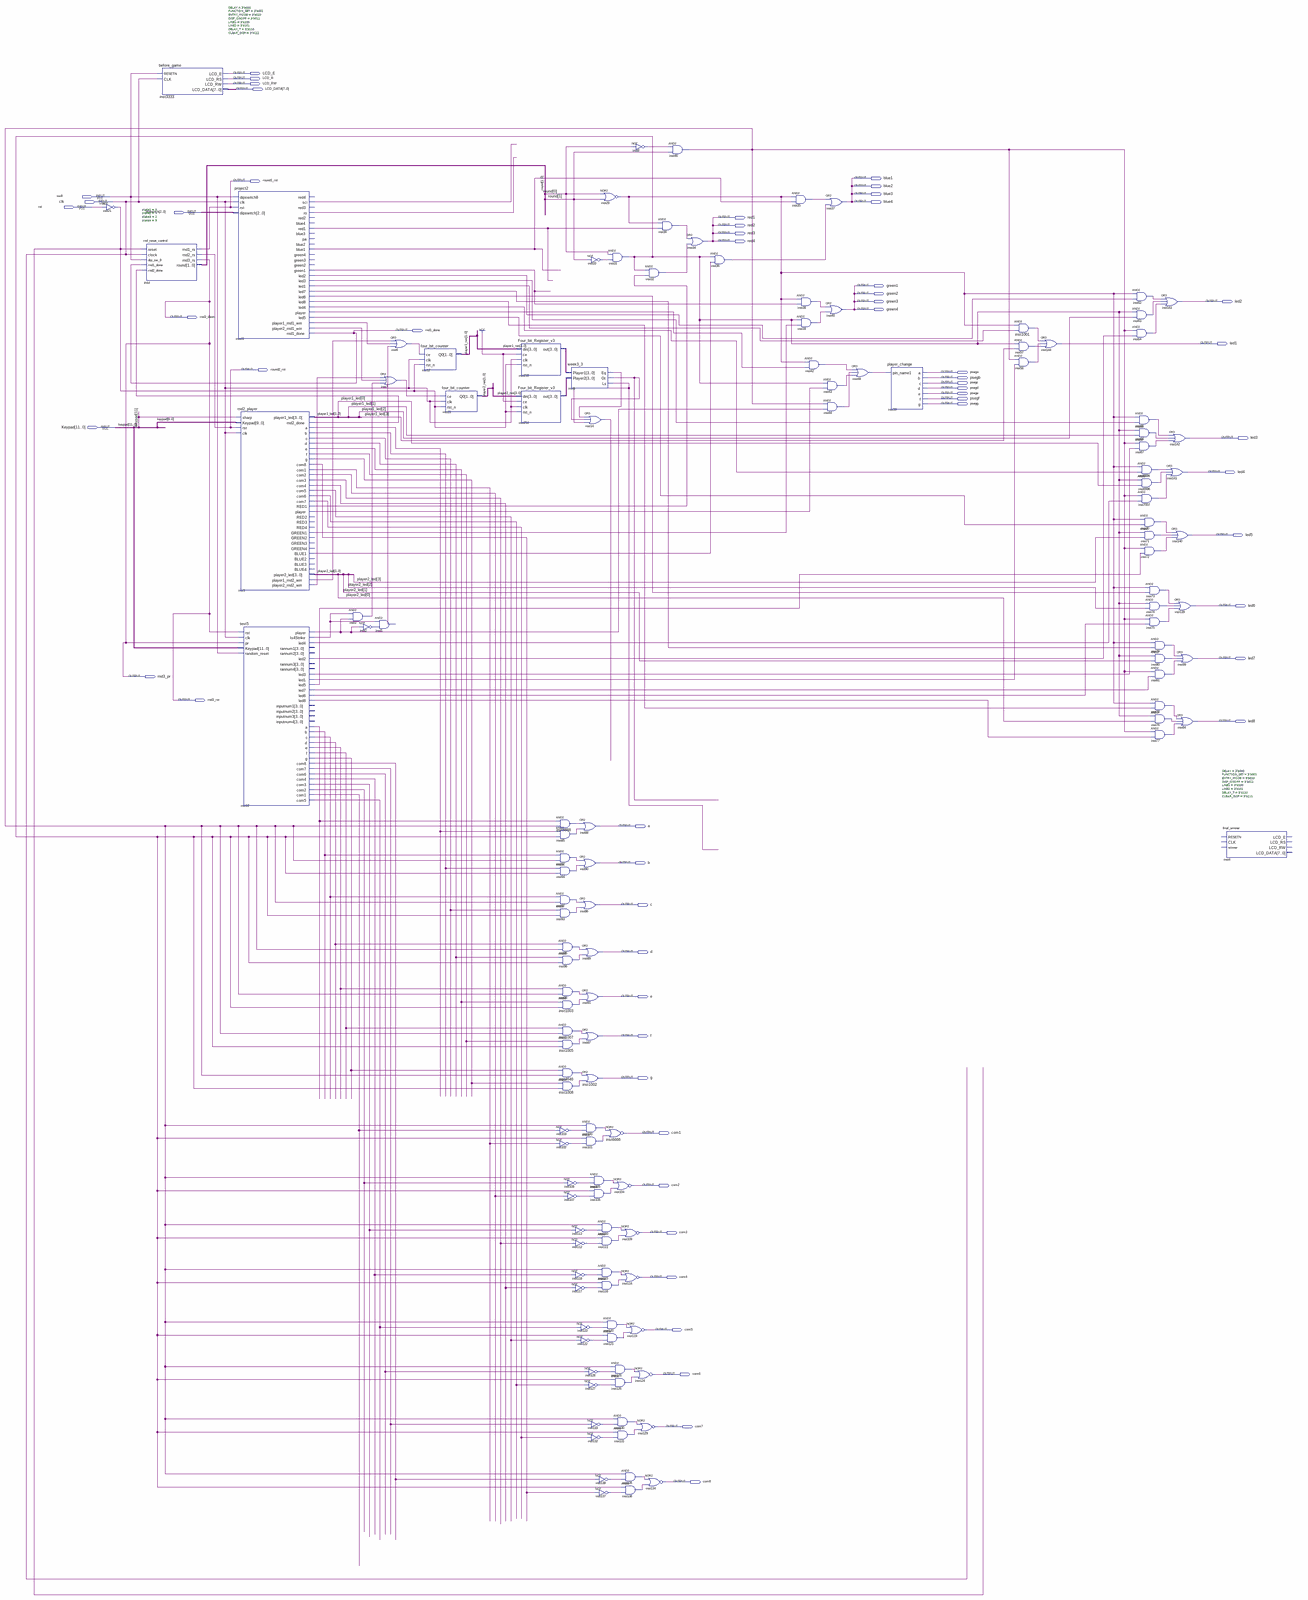
[diagram p0: schematic sheet, whole]
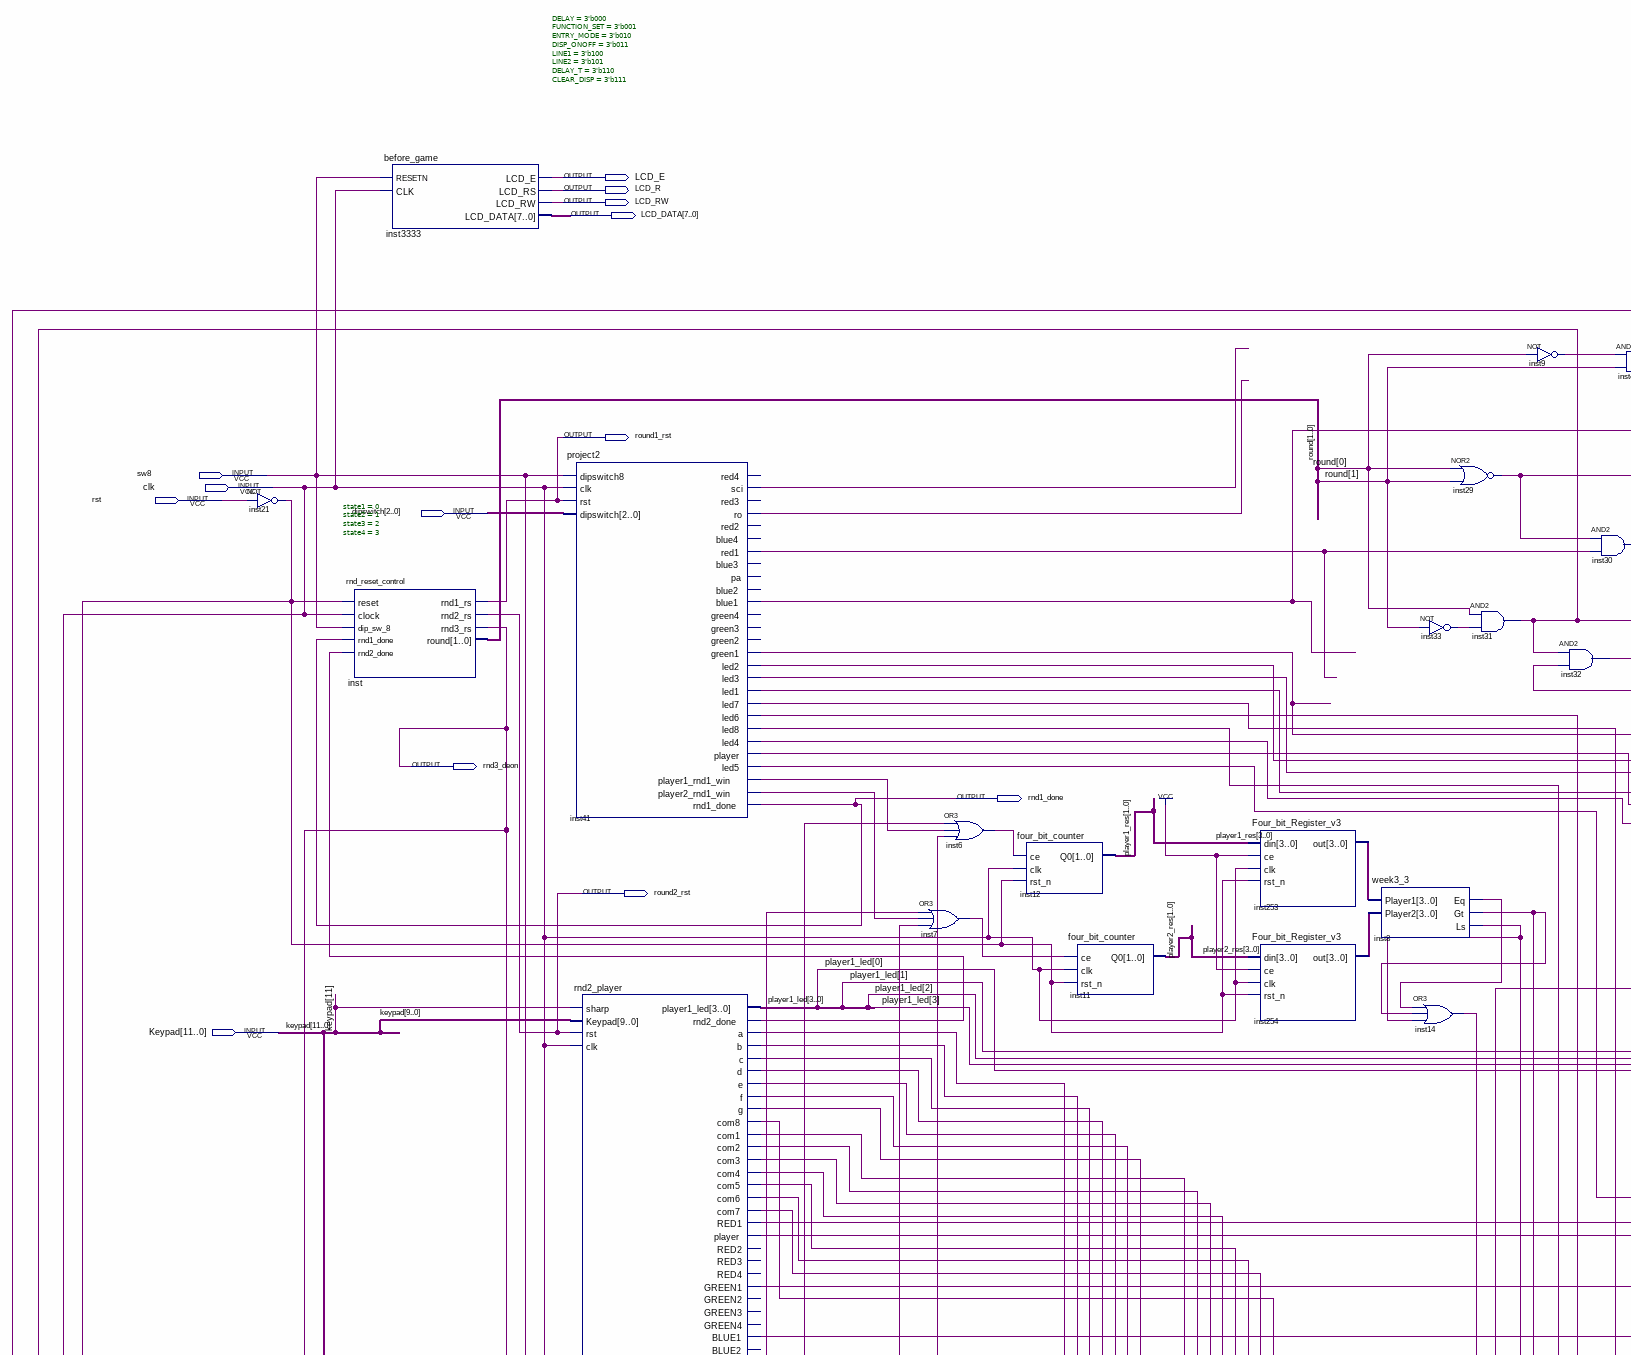
[diagram p1: schematic sheet, upper left part]
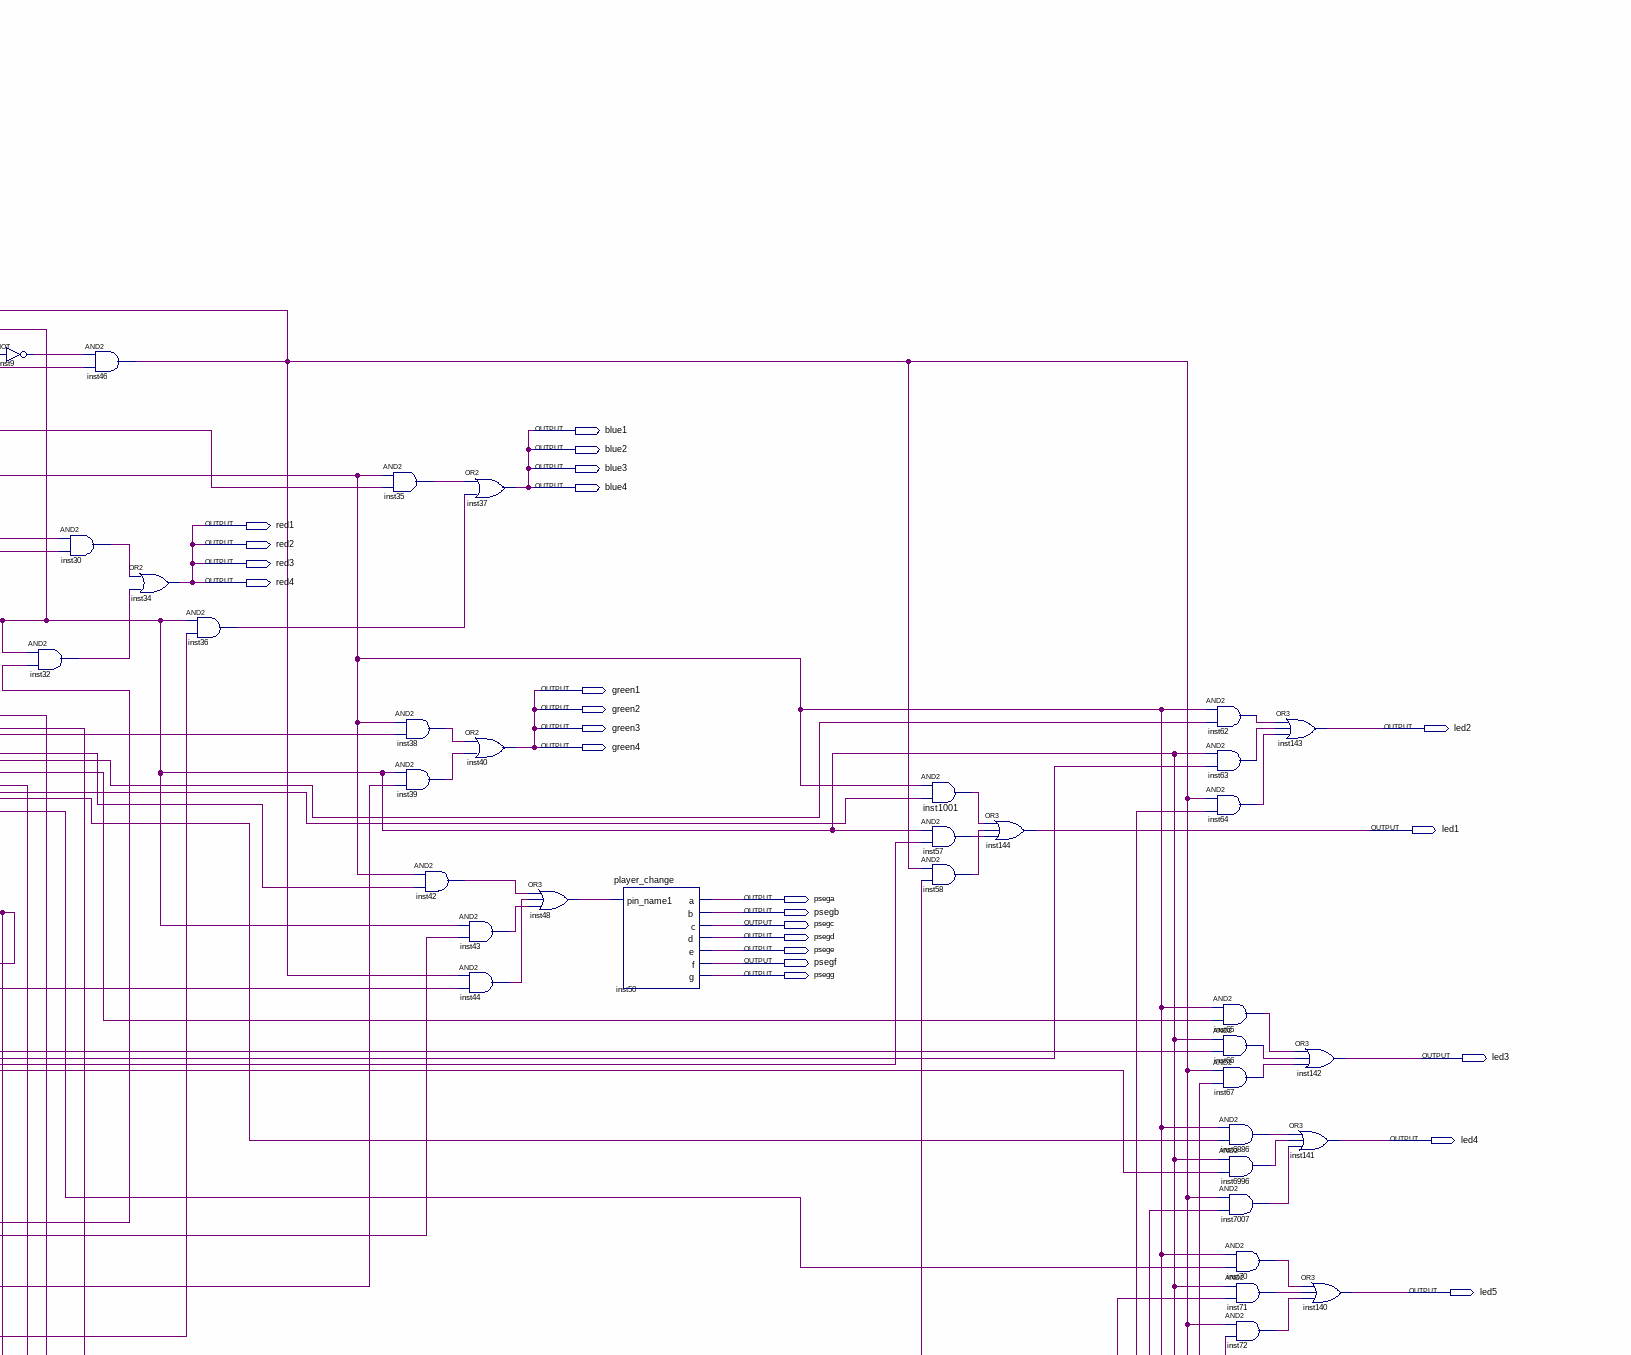
[diagram p2: schematic sheet, upper right part]
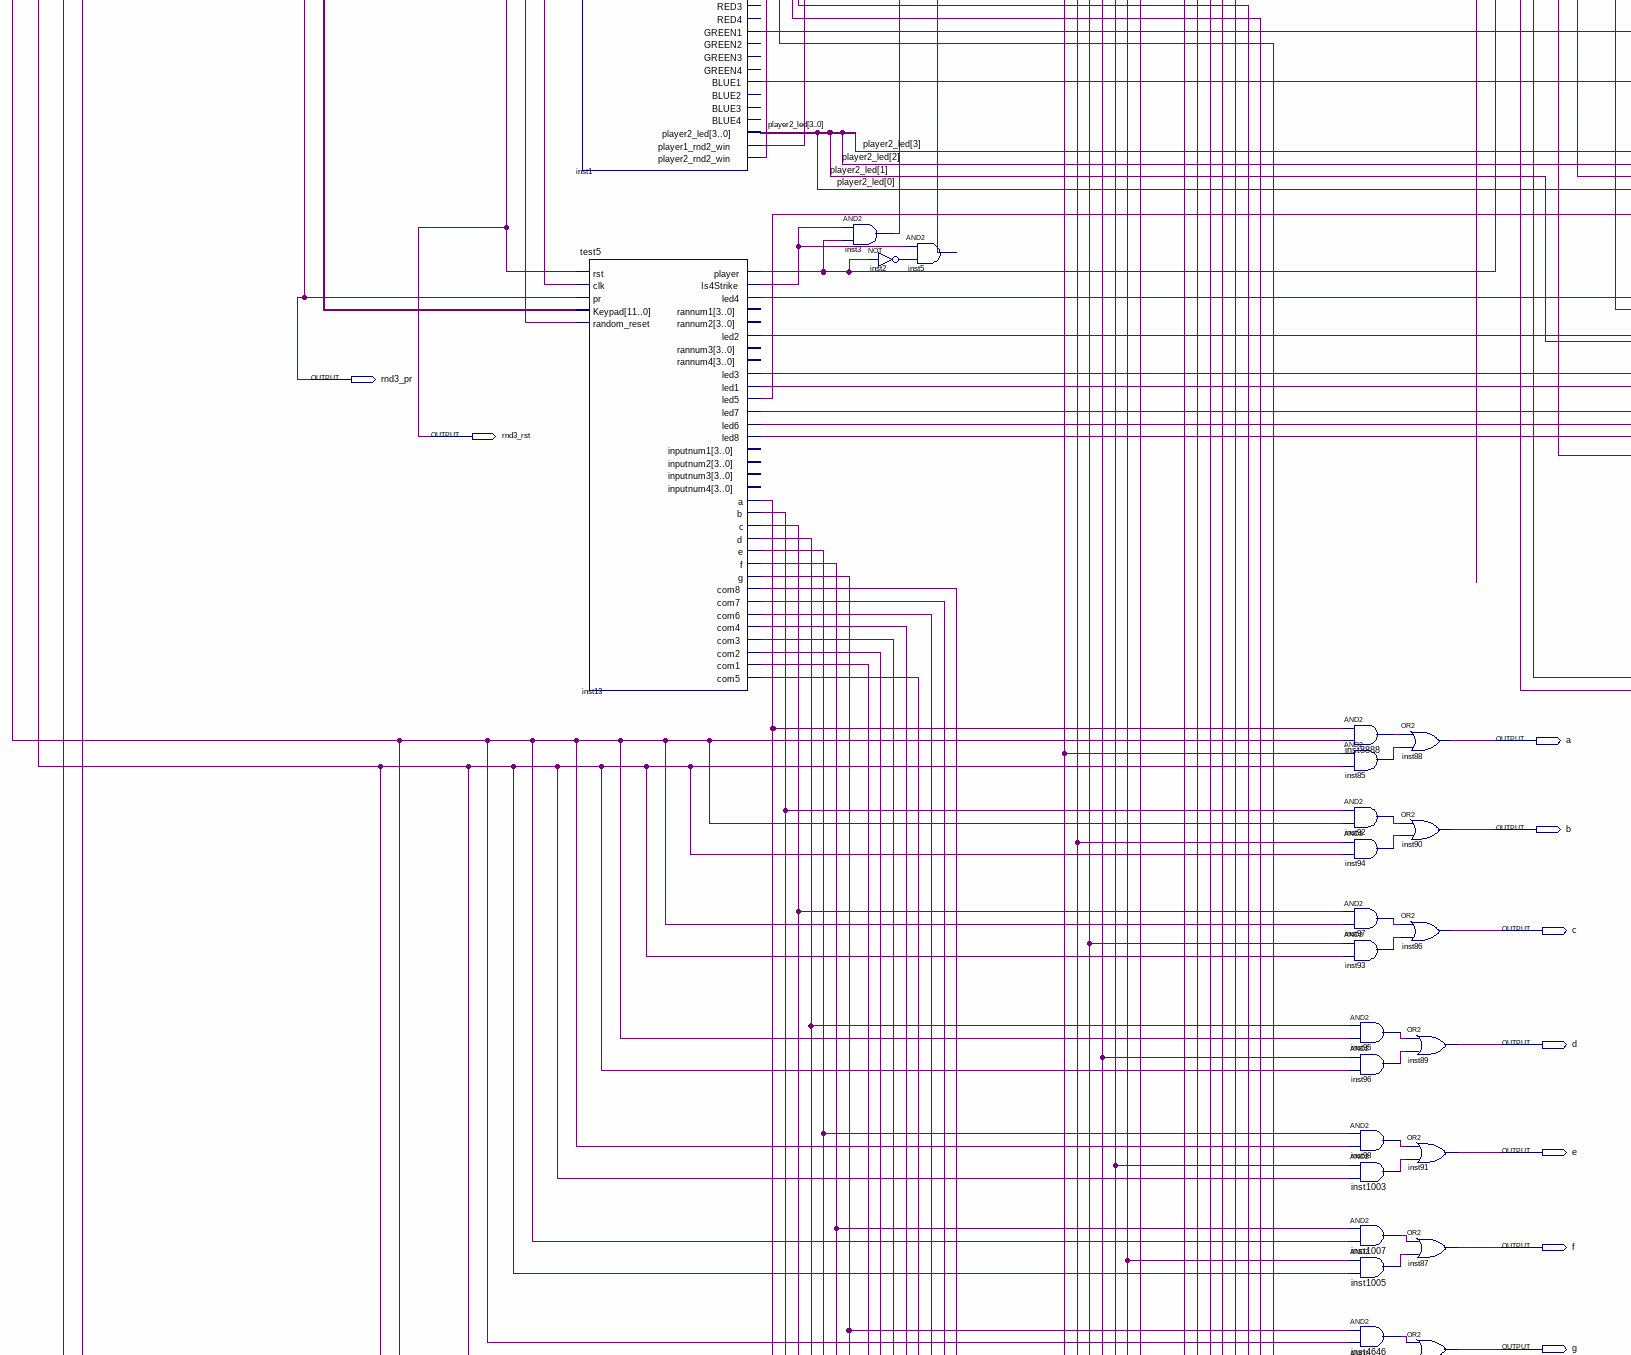
[diagram p3: schematic sheet, middle left part]
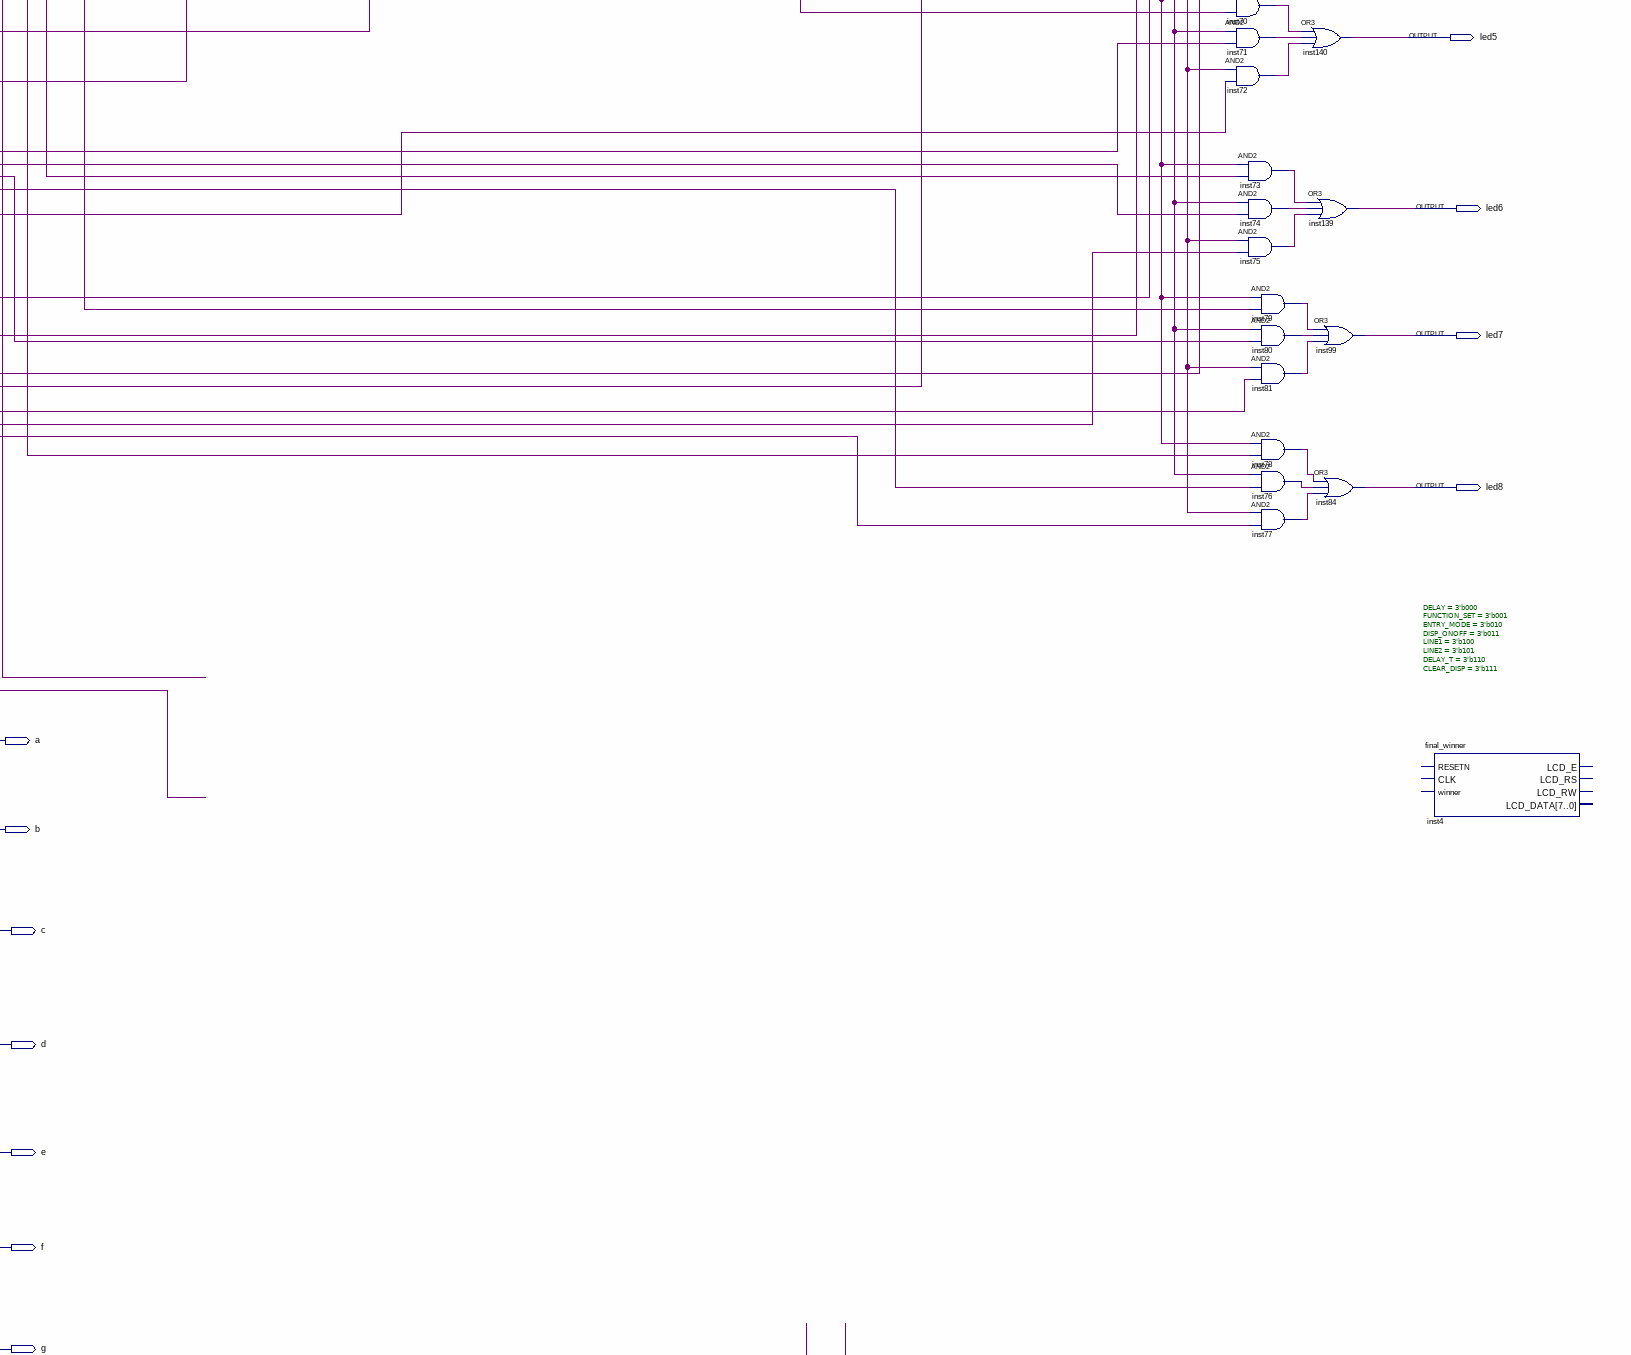
[diagram p4: schematic sheet, middle right part]
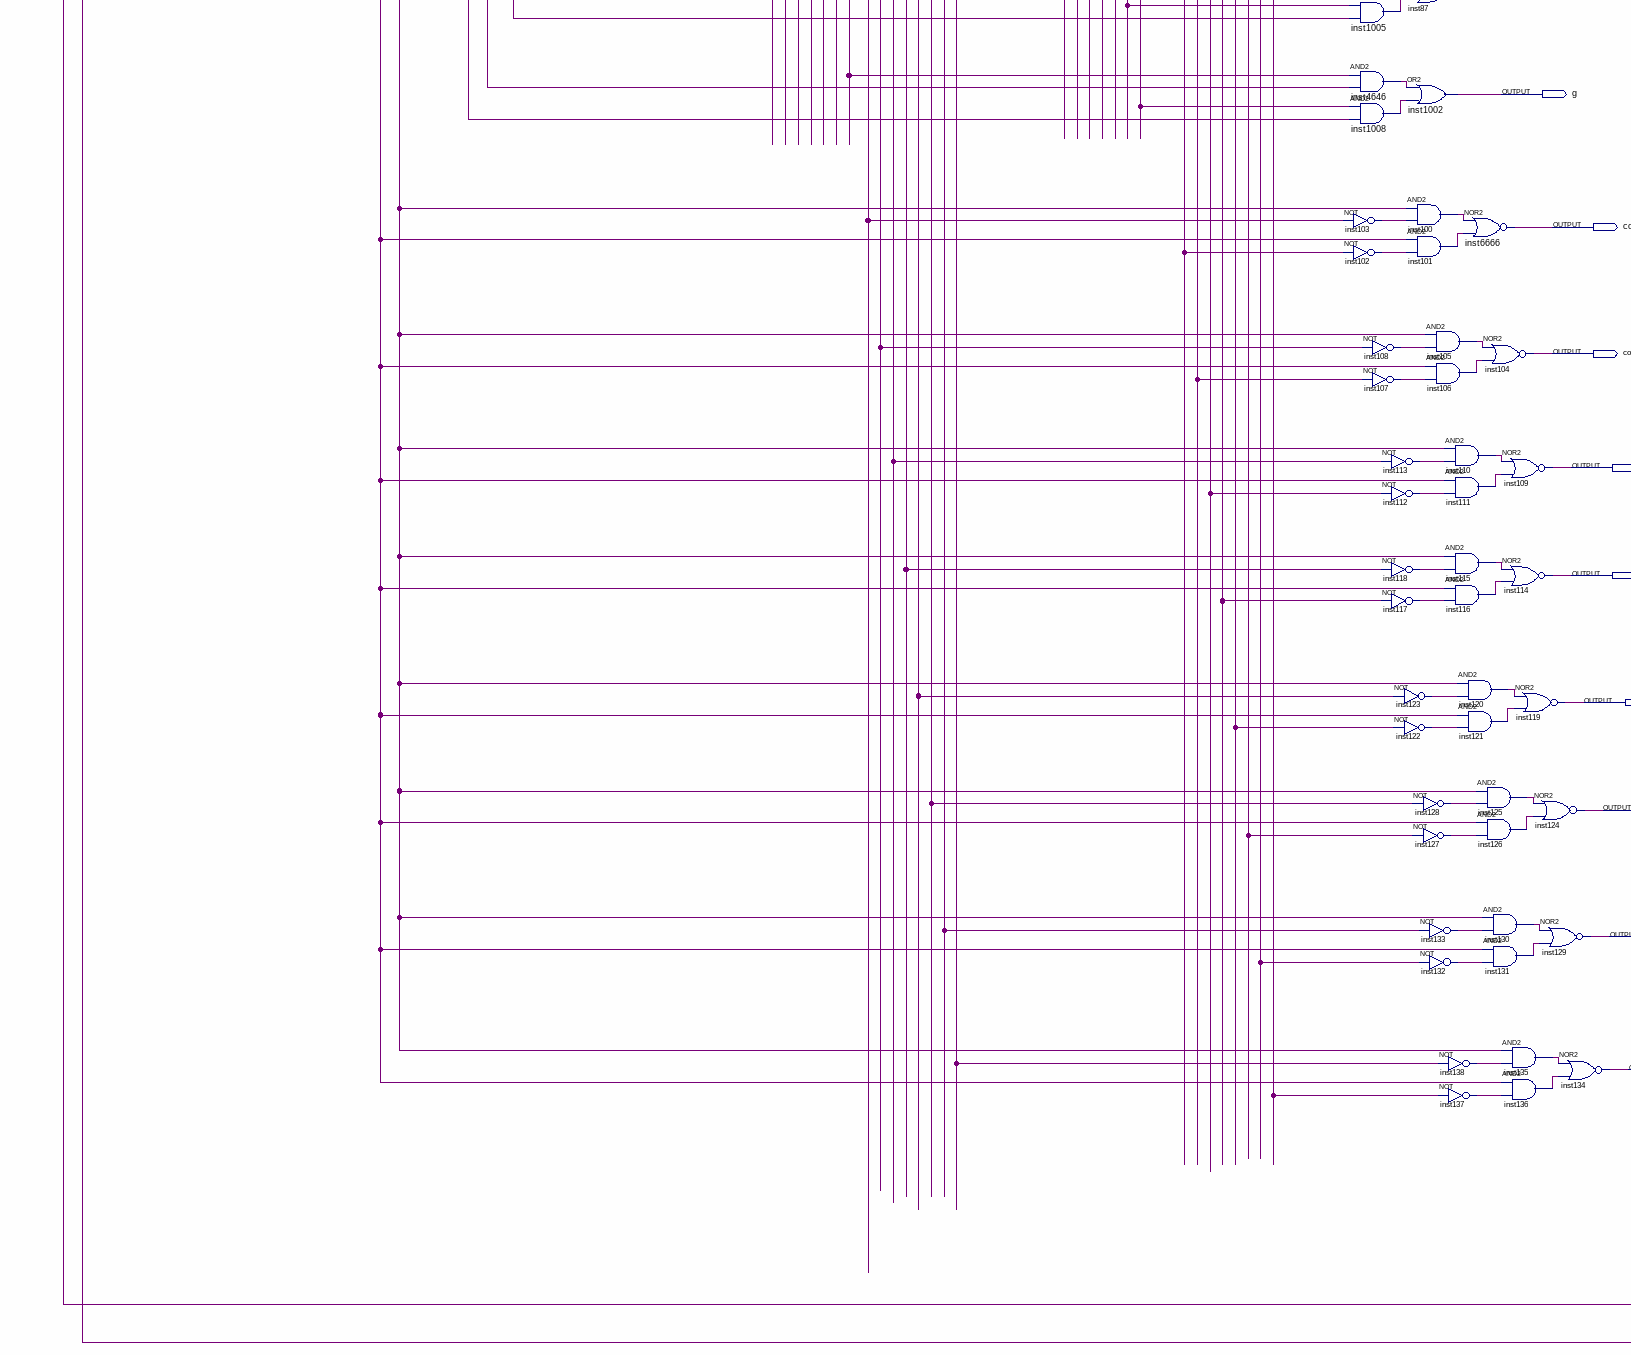
[diagram p5: schematic sheet, lower left part]
// Quartus schematic rnd123.bdf as structural Verilog: 130 symbols, 57 pins
module rnd123 (
  input  sw8,
  input  clk,
  input  rst,
  input  [2:0] dipswitch,
  input  [11:0] Keypad,
  output LCD_E,
  output LCD_R,
  output LCD_RW,
  output [7:0] LCD_DATA,
  output blue1,
  output round1_rst,
  output blue2,
  output blue3,
  output blue4,
  output red1,
  output red2,
  output red3,
  output red4,
  output green1,
  output green2,
  output green3,
  output led2,
  output green4,
  output rnd3_deon,
  output rnd1_done,
  output led1,
  output round2_rst,
  output psega,
  output psegb,
  output psegc,
  output psegd,
  output psege,
  output psegf,
  output psegg,
  output led3,
  output led4,
  output led5,
  output led6,
  output led7,
  output rnd3_pr,
  output rnd3_rst,
  output led8,
  output a,
  output b,
  output c,
  output d,
  output e,
  output f,
  output g,
  output com1,
  output com2,
  output com3,
  output com4,
  output com5,
  output com6,
  output com7,
  output com8
);

  wire inst1_a, inst1_b, inst1_blue1, inst1_c, inst1_com1, inst1_com2, inst1_com3, inst1_com4, inst1_com5,
       inst1_com6, inst1_com7, inst1_com8, inst1_d, inst1_e, inst1_f, inst1_g, inst1_green1, inst1_player,
       inst1_player1_rnd2_win, inst1_player2_rnd2_win, inst1_red1, inst1_rnd2_done, inst2_out, inst3_out,
       inst5_out, inst6_out, inst7_out, inst8_eq, inst8_gt, inst8_ls, inst9_out, inst13_a, inst13_b,
       inst13_c, inst13_com1, inst13_com2, inst13_com3, inst13_com4, inst13_com5, inst13_com6, inst13_com7,
       inst13_com8, inst13_d, inst13_e, inst13_f, inst13_g, inst13_is4strike, inst13_led1, inst13_led2,
       inst13_led3, inst13_led4, inst13_led5, inst13_led6, inst13_led7, inst13_led8, inst13_player,
       inst14_out, inst21_out, inst29_out, inst30_out, inst31_out, inst32_out, inst33_out, inst35_out,
       inst36_out, inst38_out, inst39_out, inst41_blue1, inst41_green1, inst41_led1, inst41_led2,
       inst41_led3, inst41_led4, inst41_led5, inst41_led6, inst41_led7, inst41_led8, inst41_player,
       inst41_player1_rnd1_win, inst41_player2_rnd1_win, inst41_red1, inst41_ro, inst41_sci, inst42_out,
       inst43_out, inst44_out, inst46_out, inst48_out, inst57_out, inst58_out, inst62_out, inst63_out,
       inst64_out, inst65_out, inst66_out, inst67_out, inst70_out, inst71_out, inst72_out, inst73_out,
       inst74_out, inst75_out, inst76_out, inst77_out, inst78_out, inst79_out, inst80_out, inst81_out,
       inst85_out, inst92_out, inst93_out, inst94_out, inst95_out, inst96_out, inst97_out, inst98_out,
       inst100_out, inst101_out, inst102_out, inst103_out, inst105_out, inst106_out, inst107_out,
       inst108_out, inst110_out, inst111_out, inst112_out, inst113_out, inst115_out, inst116_out,
       inst117_out, inst118_out, inst120_out, inst121_out, inst122_out, inst123_out, inst125_out,
       inst126_out, inst127_out, inst128_out, inst130_out, inst131_out, inst132_out, inst133_out,
       inst135_out, inst136_out, inst137_out, inst138_out, inst1001_out, inst1003_out, inst1005_out,
       inst1007_out, inst1008_out, inst4646_out, inst6886_out, inst6996_out, inst7007_out, inst8888_out;
  wire [1:0] round;
  wire [3:0] inst253_out, inst254_out, player1_led, player1_res, player2_led, player2_res;

  not inst21 (inst21_out, rst);
  rnd_reset_control #(.state1(0), .state2(1), .state3(2), .state4(3)) inst (
    .reset(inst21_out), .clock(clk), .dip_sw_8(sw8), .rnd1_done(rnd1_done), .rnd2_done(inst1_rnd2_done),
    .rnd1_rs(round1_rst), .rnd2_rs(round2_rst), .rnd3_rs(rnd3_deon), .round(round));
  before_game #(.DELAY(3'b000), .FUNCTION_SET(3'b001), .ENTRY_MODE(3'b010), .DISP_ONOFF(3'b011), .LINE1(3'b100), .LINE2(3'b101), .DELAY_T(3'b110), .CLEAR_DISP(3'b111)) inst3333 (
    .RESETN(sw8), .CLK(clk), .LCD_E(LCD_E), .LCD_RS(LCD_R), .LCD_RW(LCD_RW), .LCD_DATA(LCD_DATA));
  project2 inst41 (
    .dipswitch8(sw8), .clk(clk), .rst(round1_rst), .dipswitch(dipswitch), .sci(inst41_sci), .ro(inst41_ro),
    .red1(inst41_red1), .blue1(inst41_blue1), .green1(inst41_green1), .led2(inst41_led2), .led3(inst41_led3),
    .led1(inst41_led1), .led7(inst41_led7), .led6(inst41_led6), .led8(inst41_led8), .led4(inst41_led4),
    .player(inst41_player), .led5(inst41_led5), .player1_rnd1_win(inst41_player1_rnd1_win),
    .player2_rnd1_win(inst41_player2_rnd1_win), .rnd1_done(rnd1_done));  // open: red4, red3, red2, blue4, blue3, pa, blue2, green4, green3, green2
  rnd2_player inst1 (
    .sharp(Keypad[11]), .Keypad(Keypad[9:0]), .rst(round2_rst), .clk(clk), .player1_led(player1_led),
    .rnd2_done(inst1_rnd2_done), .a(inst1_a), .b(inst1_b), .c(inst1_c), .d(inst1_d), .e(inst1_e),
    .f(inst1_f), .g(inst1_g), .com8(inst1_com8), .com1(inst1_com1), .com2(inst1_com2), .com3(inst1_com3),
    .com4(inst1_com4), .com5(inst1_com5), .com6(inst1_com6), .com7(inst1_com7), .RED1(inst1_red1),
    .player(inst1_player), .GREEN1(inst1_green1), .BLUE1(inst1_blue1), .player2_led(player2_led),
    .player1_rnd2_win(inst1_player1_rnd2_win), .player2_rnd2_win(inst1_player2_rnd2_win));  // open: RED2, RED3, RED4, GREEN2, GREEN3, GREEN4, BLUE2, BLUE3, BLUE4
  test5 inst13 (
    .rst(rnd3_deon), .clk(clk), .pr(rnd3_deon), .Keypad(Keypad), .random_reset(sw8), .player(inst13_player),
    .Is4Strike(inst13_is4strike), .led4(inst13_led4), .led2(inst13_led2), .led3(inst13_led3),
    .led1(inst13_led1), .led5(inst13_led5), .led7(inst13_led7), .led6(inst13_led6), .led8(inst13_led8),
    .a(inst13_a), .b(inst13_b), .c(inst13_c), .d(inst13_d), .e(inst13_e), .f(inst13_f), .g(inst13_g),
    .com8(inst13_com8), .com7(inst13_com7), .com6(inst13_com6), .com4(inst13_com4), .com3(inst13_com3),
    .com2(inst13_com2), .com1(inst13_com1), .com5(inst13_com5));  // open: rannum1, rannum2, rannum3, rannum4, inputnum1, inputnum2, inputnum3, inputnum4
  and inst3 (inst3_out, inst13_is4strike, inst13_player);
  not inst2 (inst2_out, inst13_player);
  or inst6 (inst6_out, inst1_player1_rnd2_win, inst41_player1_rnd1_win, inst5_out);
  or inst7 (inst7_out, inst1_player2_rnd2_win, inst41_player2_rnd1_win, inst3_out);
  and inst5 (inst5_out, inst13_is4strike, inst2_out);
  four_bit_counter inst12 (.ce(inst6_out), .clk(clk), .rst_n(inst21_out), .Q0(player1_res[1:0]));
  four_bit_counter inst11 (.ce(inst7_out), .clk(clk), .rst_n(inst21_out), .Q0(player2_res[1:0]));
  Four_bit_Register_v3 inst253 (.din(player1_res), .ce(1'b1), .clk(clk), .rst_n(inst21_out), .out(inst253_out));
  Four_bit_Register_v3 inst254 (.din(player2_res), .ce(1'b1), .clk(clk), .rst_n(inst21_out), .out(inst254_out));
  and inst8888 (inst8888_out, inst13_a, inst46_out);
  and inst85 (inst85_out, inst1_a, inst31_out);
  and inst92 (inst92_out, inst13_b, inst46_out);
  and inst94 (inst94_out, inst1_b, inst31_out);
  and inst97 (inst97_out, inst13_c, inst46_out);
  and inst93 (inst93_out, inst1_c, inst31_out);
  and inst95 (inst95_out, inst13_d, inst46_out);
  and inst96 (inst96_out, inst1_d, inst31_out);
  and inst98 (inst98_out, inst13_e, inst46_out);
  and inst1003 (inst1003_out, inst1_e, inst31_out);
  and inst1007 (inst1007_out, inst13_f, inst46_out);
  and inst1005 (inst1005_out, inst1_f, inst31_out);
  and inst4646 (inst4646_out, inst13_g, inst46_out);
  and inst1008 (inst1008_out, inst1_g, inst31_out);
  not inst103 (inst103_out, inst13_com1);
  not inst102 (inst102_out, inst1_com1);
  week3_3 inst8 (.Player1(inst253_out), .Player2(inst254_out), .Eq(inst8_eq), .Gt(inst8_gt), .Ls(inst8_ls));
  or inst88 (a, inst8888_out, inst85_out);
  or inst90 (b, inst92_out, inst94_out);
  or inst86 (c, inst97_out, inst93_out);
  or inst89 (d, inst95_out, inst96_out);
  or inst91 (e, inst98_out, inst1003_out);
  or inst87 (f, inst1007_out, inst1005_out);
  or inst1002 (g, inst4646_out, inst1008_out);
  and inst100 (inst100_out, inst46_out, inst103_out);
  and inst101 (inst101_out, inst31_out, inst102_out);
  not inst108 (inst108_out, inst13_com2);
  not inst107 (inst107_out, inst1_com2);
  not inst113 (inst113_out, inst13_com3);
  not inst112 (inst112_out, inst1_com3);
  not inst118 (inst118_out, inst13_com4);
  not inst117 (inst117_out, inst1_com4);
  not inst123 (inst123_out, inst13_com5);
  not inst122 (inst122_out, inst1_com5);
  nor inst29 (inst29_out, round[0], round[1]);
  not inst33 (inst33_out, round[1]);
  or inst14 (inst14_out, inst8_eq, inst8_gt, inst8_ls);
  and inst105 (inst105_out, inst46_out, inst108_out);
  and inst106 (inst106_out, inst31_out, inst107_out);
  and inst110 (inst110_out, inst46_out, inst113_out);
  and inst111 (inst111_out, inst31_out, inst112_out);
  and inst115 (inst115_out, inst46_out, inst118_out);
  and inst116 (inst116_out, inst31_out, inst117_out);
  and inst120 (inst120_out, inst46_out, inst123_out);
  and inst121 (inst121_out, inst31_out, inst122_out);
  not inst128 (inst128_out, inst13_com6);
  not inst127 (inst127_out, inst1_com6);
  not inst133 (inst133_out, inst13_com7);
  not inst132 (inst132_out, inst1_com7);
  not inst138 (inst138_out, inst13_com8);
  not inst137 (inst137_out, inst1_com8);
  and inst31 (inst31_out, round[0], inst33_out);
  nor inst6666 (com1, inst100_out, inst101_out);
  nor inst104 (com2, inst105_out, inst106_out);
  nor inst109 (com3, inst110_out, inst111_out);
  nor inst114 (com4, inst115_out, inst116_out);
  and inst125 (inst125_out, inst46_out, inst128_out);
  and inst126 (inst126_out, inst31_out, inst127_out);
  and inst130 (inst130_out, inst46_out, inst133_out);
  and inst131 (inst131_out, inst31_out, inst132_out);
  and inst135 (inst135_out, inst46_out, inst138_out);
  and inst136 (inst136_out, inst31_out, inst137_out);
  not inst9 (inst9_out, round[0]);
  and inst32 (inst32_out, inst31_out, inst1_red1);
  nor inst119 (com5, inst120_out, inst121_out);
  nor inst124 (com6, inst125_out, inst126_out);
  nor inst129 (com7, inst130_out, inst131_out);
  nor inst134 (com8, inst135_out, inst136_out);
  and inst30 (inst30_out, inst29_out, inst41_red1);
  and inst46 (inst46_out, inst9_out, round[1]);
  or inst34 (red1, inst30_out, inst32_out);
  and inst36 (inst36_out, inst31_out, inst1_blue1);
  and inst35 (inst35_out, inst29_out, inst41_blue1);
  and inst38 (inst38_out, inst29_out, inst41_green1);
  and inst39 (inst39_out, inst31_out, inst1_green1);
  and inst42 (inst42_out, inst29_out, inst41_player);
  or inst37 (blue1, inst35_out, inst36_out);
  or inst40 (green1, inst38_out, inst39_out);
  and inst43 (inst43_out, inst31_out, inst1_player);
  and inst44 (inst44_out, inst46_out, inst13_player);
  or inst48 (inst48_out, inst42_out, inst44_out, inst43_out);
  player_change inst50 (
    .pin_name1(inst48_out), .a(psega), .b(psegb), .c(psegc), .d(psegd), .e(psege), .f(psegf), .g(psegg));
  and inst1001 (inst1001_out, inst29_out, inst41_led1);
  and inst57 (inst57_out, inst31_out, player1_led[3]);
  and inst58 (inst58_out, inst46_out, inst13_led1);
  or inst144 (led1, inst1001_out, inst58_out, inst57_out);
  and inst62 (inst62_out, inst29_out, inst41_led2);
  and inst63 (inst63_out, inst31_out, player1_led[2]);
  and inst64 (inst64_out, inst46_out, inst13_led2);
  and inst65 (inst65_out, inst29_out, inst41_led3);
  and inst66 (inst66_out, inst31_out, player1_led[1]);
  and inst67 (inst67_out, inst46_out, inst13_led3);
  and inst6886 (inst6886_out, inst29_out, inst41_led4);
  and inst6996 (inst6996_out, inst31_out, player1_led[0]);
  and inst7007 (inst7007_out, inst46_out, inst13_led4);
  and inst70 (inst70_out, inst29_out, inst41_led5);
  and inst71 (inst71_out, inst31_out, player2_led[3]);
  and inst72 (inst72_out, inst46_out, inst13_led5);
  and inst73 (inst73_out, inst29_out, inst41_led6);
  and inst74 (inst74_out, inst31_out, player2_led[2]);
  and inst75 (inst75_out, inst46_out, inst13_led6);
  or inst143 (led2, inst62_out, inst63_out, inst64_out);
  or inst142 (led3, inst65_out, inst66_out, inst67_out);
  or inst141 (led4, inst6886_out, inst6996_out, inst7007_out);
  and inst79 (inst79_out, inst29_out, inst41_led7);
  and inst80 (inst80_out, inst31_out, player2_led[1]);
  and inst81 (inst81_out, inst46_out, inst13_led7);
  and inst78 (inst78_out, inst29_out, inst41_led8);
  and inst76 (inst76_out, inst31_out, player2_led[0]);
  and inst77 (inst77_out, inst46_out, inst13_led8);
  or inst140 (led5, inst70_out, inst71_out, inst72_out);
  or inst139 (led6, inst73_out, inst74_out, inst75_out);
  or inst99 (led7, inst79_out, inst80_out, inst81_out);
  or inst84 (led8, inst78_out, inst76_out, inst77_out);
  final_winner #(.DELAY(3'b000), .FUNCTION_SET(3'b001), .ENTRY_MODE(3'b010), .DISP_ONOFF(3'b011), .LINE1(3'b100), .LINE2(3'b101), .DELAY_T(3'b110), .CLEAR_DISP(3'b111)) inst4 ();  // open: RESETN, CLK, winner, LCD_E, LCD_RS, LCD_RW, LCD_DATA

  assign blue2 = blue1;
  assign blue3 = blue1;
  assign blue4 = blue1;
  assign green2 = green1;
  assign green3 = green1;
  assign green4 = green1;
  assign red2 = red1;
  assign red3 = red1;
  assign red4 = red1;
  assign rnd3_pr = rnd3_deon;
  assign rnd3_rst = rnd3_deon;
endmodule
